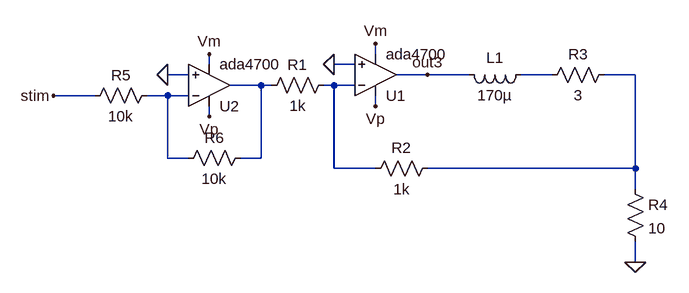
[diagram p0: schematic diesunddas.asc]
diesunddas.asc, the LTspice schematic file:
Version 4
SHEET 1 880 680
WIRE -112 -160 -112 -176
WIRE -368 -144 -368 -160
WIRE -144 -144 -176 -144
WIRE -400 -128 -432 -128
WIRE -32 -128 -80 -128
WIRE 32 -128 -32 -128
WIRE 160 -128 112 -128
WIRE 288 -128 240 -128
WIRE -288 -112 -336 -112
WIRE -272 -112 -288 -112
WIRE -176 -112 -192 -112
WIRE -144 -112 -176 -112
WIRE -544 -96 -608 -96
WIRE -432 -96 -464 -96
WIRE -400 -96 -432 -96
WIRE -112 -80 -112 -96
WIRE -368 -64 -368 -80
WIRE -432 0 -432 -96
WIRE -400 0 -432 0
WIRE -288 0 -288 -112
WIRE -288 0 -320 0
WIRE -176 16 -176 -112
WIRE -112 16 -176 16
WIRE 288 16 288 -128
WIRE 288 16 -32 16
WIRE 288 48 288 16
WIRE 288 160 288 128
FLAG -112 -176 Vm
FLAG -112 -80 Vp
FLAG -608 -96 stim
FLAG -32 -128 out3
FLAG 288 160 0
FLAG -176 -144 0
FLAG -368 -160 Vm
FLAG -368 -64 Vp
FLAG -432 -128 0
SYMBOL Opamps\\opamp2 -112 -64 M180
SYMATTR InstName U1
SYMATTR Value ada4700
SYMATTR SpiceModel ada4700
SYMBOL res -176 -128 R90
WINDOW 0 0 56 VBottom 2
WINDOW 3 32 56 VTop 2
SYMATTR InstName R1
SYMATTR Value 1k
SYMBOL res -16 0 R90
WINDOW 0 0 56 VBottom 2
WINDOW 3 32 56 VTop 2
SYMATTR InstName R2
SYMATTR Value 1k
SYMBOL res 256 -144 R90
WINDOW 0 0 56 VBottom 2
WINDOW 3 32 56 VTop 2
SYMATTR InstName R3
SYMATTR Value 3
SYMBOL ind 128 -144 R90
WINDOW 0 5 56 VBottom 2
WINDOW 3 32 56 VTop 2
SYMATTR InstName L1
SYMATTR Value 170µ
SYMBOL res 272 32 R0
SYMATTR InstName R4
SYMATTR Value 10
SYMBOL Opamps\\opamp2 -368 -48 M180
SYMATTR InstName U2
SYMATTR Value ada4700
SYMATTR SpiceModel ada4700
SYMBOL res -448 -112 R90
WINDOW 0 0 56 VBottom 2
WINDOW 3 32 56 VTop 2
SYMATTR InstName R5
SYMATTR Value 10k
SYMBOL res -304 -16 R90
WINDOW 0 0 56 VBottom 2
WINDOW 3 32 56 VTop 2
SYMATTR InstName R6
SYMATTR Value 10k

The netlist it stands for:
* diesunddas.asc
XU1 0 N004 Vp Vm out3 ada4700 ada4700  ; pins In+ In- V+ V- OUT
R1 N004 N003 1k
R2 N002 N004 1k
R3 N002 N001 3
L1 N001 out3 170µ
R4 N002 0 10
XU2 0 N005 Vp Vm N003 ada4700 ada4700  ; pins In+ In- V+ V- OUT
R5 N005 stim 10k
R6 N003 N005 10k
.backanno
.end